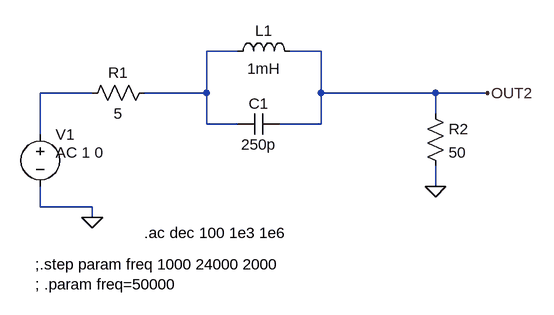
[diagram p0: schematic CircuitBouchon5.asc]
CircuitBouchon5.asc, the LTspice schematic file:
Version 4
SHEET 1 880 680
WIRE 352 16 304 16
WIRE 480 16 432 16
WIRE 128 80 48 80
WIRE 304 80 304 16
WIRE 304 80 208 80
WIRE 480 80 480 16
WIRE 656 80 480 80
WIRE 736 80 656 80
WIRE 656 112 656 80
WIRE 304 128 304 80
WIRE 352 128 304 128
WIRE 480 128 480 80
WIRE 480 128 416 128
WIRE 48 144 48 80
WIRE 656 224 656 192
WIRE 48 256 48 224
WIRE 128 256 48 256
WIRE 128 272 128 256
FLAG 128 272 0
FLAG 736 80 OUT2
FLAG 656 224 0
SYMBOL voltage 48 128 R0
WINDOW 123 24 44 Left 2
WINDOW 39 0 0 Left 0
WINDOW 3 24 44 Left 2
SYMATTR Value2 AC 1 0
SYMATTR Value ""
SYMATTR InstName V1
SYMBOL res 224 64 R90
WINDOW 0 0 56 VBottom 2
WINDOW 3 32 56 VTop 2
SYMATTR InstName R1
SYMATTR Value 5
SYMBOL cap 416 112 R90
WINDOW 0 0 32 VBottom 2
WINDOW 3 32 32 VTop 2
SYMATTR InstName C1
SYMATTR Value 250p
SYMBOL ind 336 32 R270
WINDOW 0 32 56 VTop 2
WINDOW 3 5 56 VBottom 2
SYMATTR InstName L1
SYMATTR Value 1mH
SYMBOL res 640 96 R0
SYMATTR InstName R2
SYMATTR Value 50
TEXT 40 344 Left 2 !;.step param freq 1000 24000 2000\n; .param freq=50000
TEXT 208 296 Left 2 !.ac dec 100 1e3 1e6

The netlist it stands for:
* CircuitBouchon5.asc
V1 N002 0 AC 1 0
R1 N001 N002 5
C1 OUT2 N001 250p
L1 N001 OUT2 1mH
R2 OUT2 0 50
;.step param freq 1000 24000 2000
; .param freq=50000
.ac dec 100 1e3 1e6
.backanno
.end